# Altium schematic sheet DC_MotorDriver.SchDoc
size A4; SheetNumber: 1; SheetTotal: 1
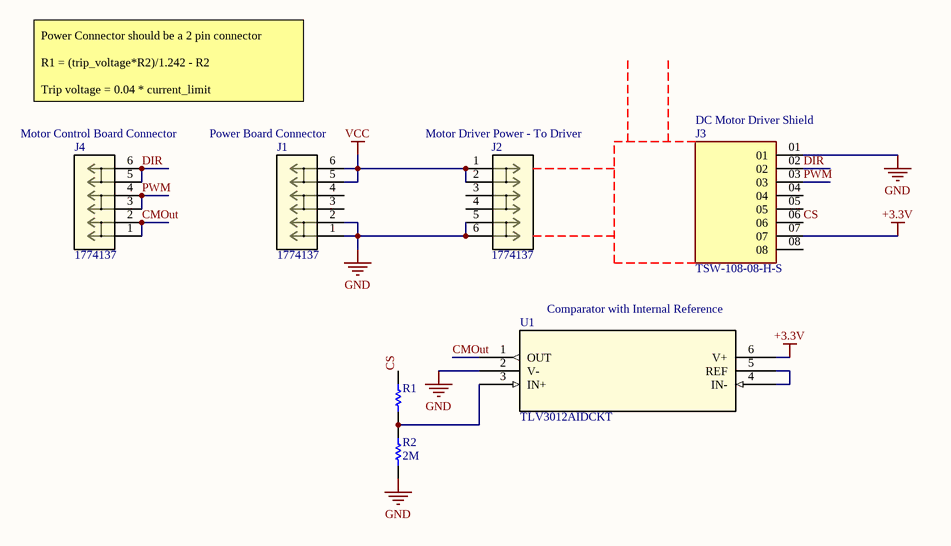
[diagram p0: DC_MotorDriver.SchDoc]

## Parts
J1  1774137  [CONN_1774137]
J2  1774137  [CONN_1774137]
J3  TSW-108-08-H-S  [SAMTEC_TSW-108-08-H-S]
J4  1774137  [CONN_1774137]
R1  (no value)  [RES_0603]
R2  2M  [RES_0603]
U1  TLV3012AIDCKT  [DCK6]

## Nets
+3.3V: J3.07 U1.6(V+)
GND: J1.1 J1.2 J2.5 J2.6 J3.01 R2.1 U1.2(V-)
VCC: J1.5 J1.6 J2.1 J2.2
CMOut: J4.1 J4.2 U1.1(OUT)
CS: J3.06 R1.2
DIR: J3.02 J4.5 J4.6
PWM: J3.03 J4.3 J4.4
NetR1_1: R1.1 R2.2 U1.3(IN+)
NetU1_4: U1.4(IN-) U1.5(REF)

Not connected (* = marked no-connect by the designer): J1 3 4; J2 3 4; J3 04 05 08

## Notes on the sheet
- Power Connector should be a 2 pin connector
  R1 = (trip_voltage*R2)/1.242 - R2
  Trip voltage = 0.04 * current_limit
- (near J4) Motor Control Board Connector
- (near J1) Power Board Connector
- (near J2) Motor Driver Power - To Driver
- (near J3) DC Motor Driver Shield
- Comparator with Internal Reference

## Library data of the parts
J1 J2 J4 = 1774137: No Description Available; Mfr_Name: Phoenix Contact; Copyright: Copyright (C) 2022 Ultra Librarian. All rights reserved.; Manufacturer_Part_Number: 1774137; Digi-Key_Part_Number_1: 277-6019-ND; RefDes: RefDes; Type: DEV
R1 R2 = 249_1%_0603: RES SMD 249 OHM 1% 1/10W 0603; Manufacturer: Panasonic Electronic Components; Manufacturer Part Number: ERJ-3EKF2490V; Resistance (Ohms): 249; Power (Watts): 0.1W, 1/10W; Temperature Coefficient: ±100ppm/°C; Supplier 1: Digi-Key; Supplier Part Number 1: P249HCT-ND; RoHS: RoHS Compliant; Category: Resistors; Stock 1: 174505; Pricing 1: 1=0.14, 50=0.0206, 100=0.0157, 250=0.01164, 500=0.0086, 1000=0.00574, 2500=0.00484 (CAD); Packaging: Cut Tape (CT); Tolerance: ±1%; Composition: Thick Film; Features: Automotive AEC-Q200; Operating Temperature: -55°C ~ 155°C; Package / Case: 0603 (1608 Metric); Supplier Device Package: 0603; Size / Dimension: 0.063" L x 0.031" W (1.60mm x 0.80mm); Height: 0.022" (0.55mm); Number of Terminations: 2; ComponentLink1URL: http://industrial.panasonic.com/www-cgi/jvcr13pz.cgi?E+PZ+3+AOA0002+ERJ3EKF2490V+7+WW; ComponentLink1Description: http://industrial.panasonic.com/www-cgi/jvcr13pz.cgi?E+PZ+3+AOA0002+ERJ3EKF2490V+7+WW
U1 = TLV3012AIDCKT: No Description Available; Mfr_Name: Texas Instruments; Copyright: Copyright (C) 2022 Ultra Librarian. All rights reserved.; Manufacturer_Part_Number: TLV3012AIDCKT; Digi-Key_Part_Number_1: 296-17118-1-ND; Digi-Key_Part_Number_2: 296-17118-2-ND; Digi-Key_Part_Number_3: 296-17118-6-ND; Digi-Key_Part_Number_4: 2156-TLV3012AIDCKT-ND; RefDes: RefDes; Type: DEV
J3 = TSW-108-08-H-S: Package: None; Price: None; Value: *; MP: TSW-108-08-H-S; Availability: Unavailable